# EAGLE schematic untitled (EAGLE 6.4)
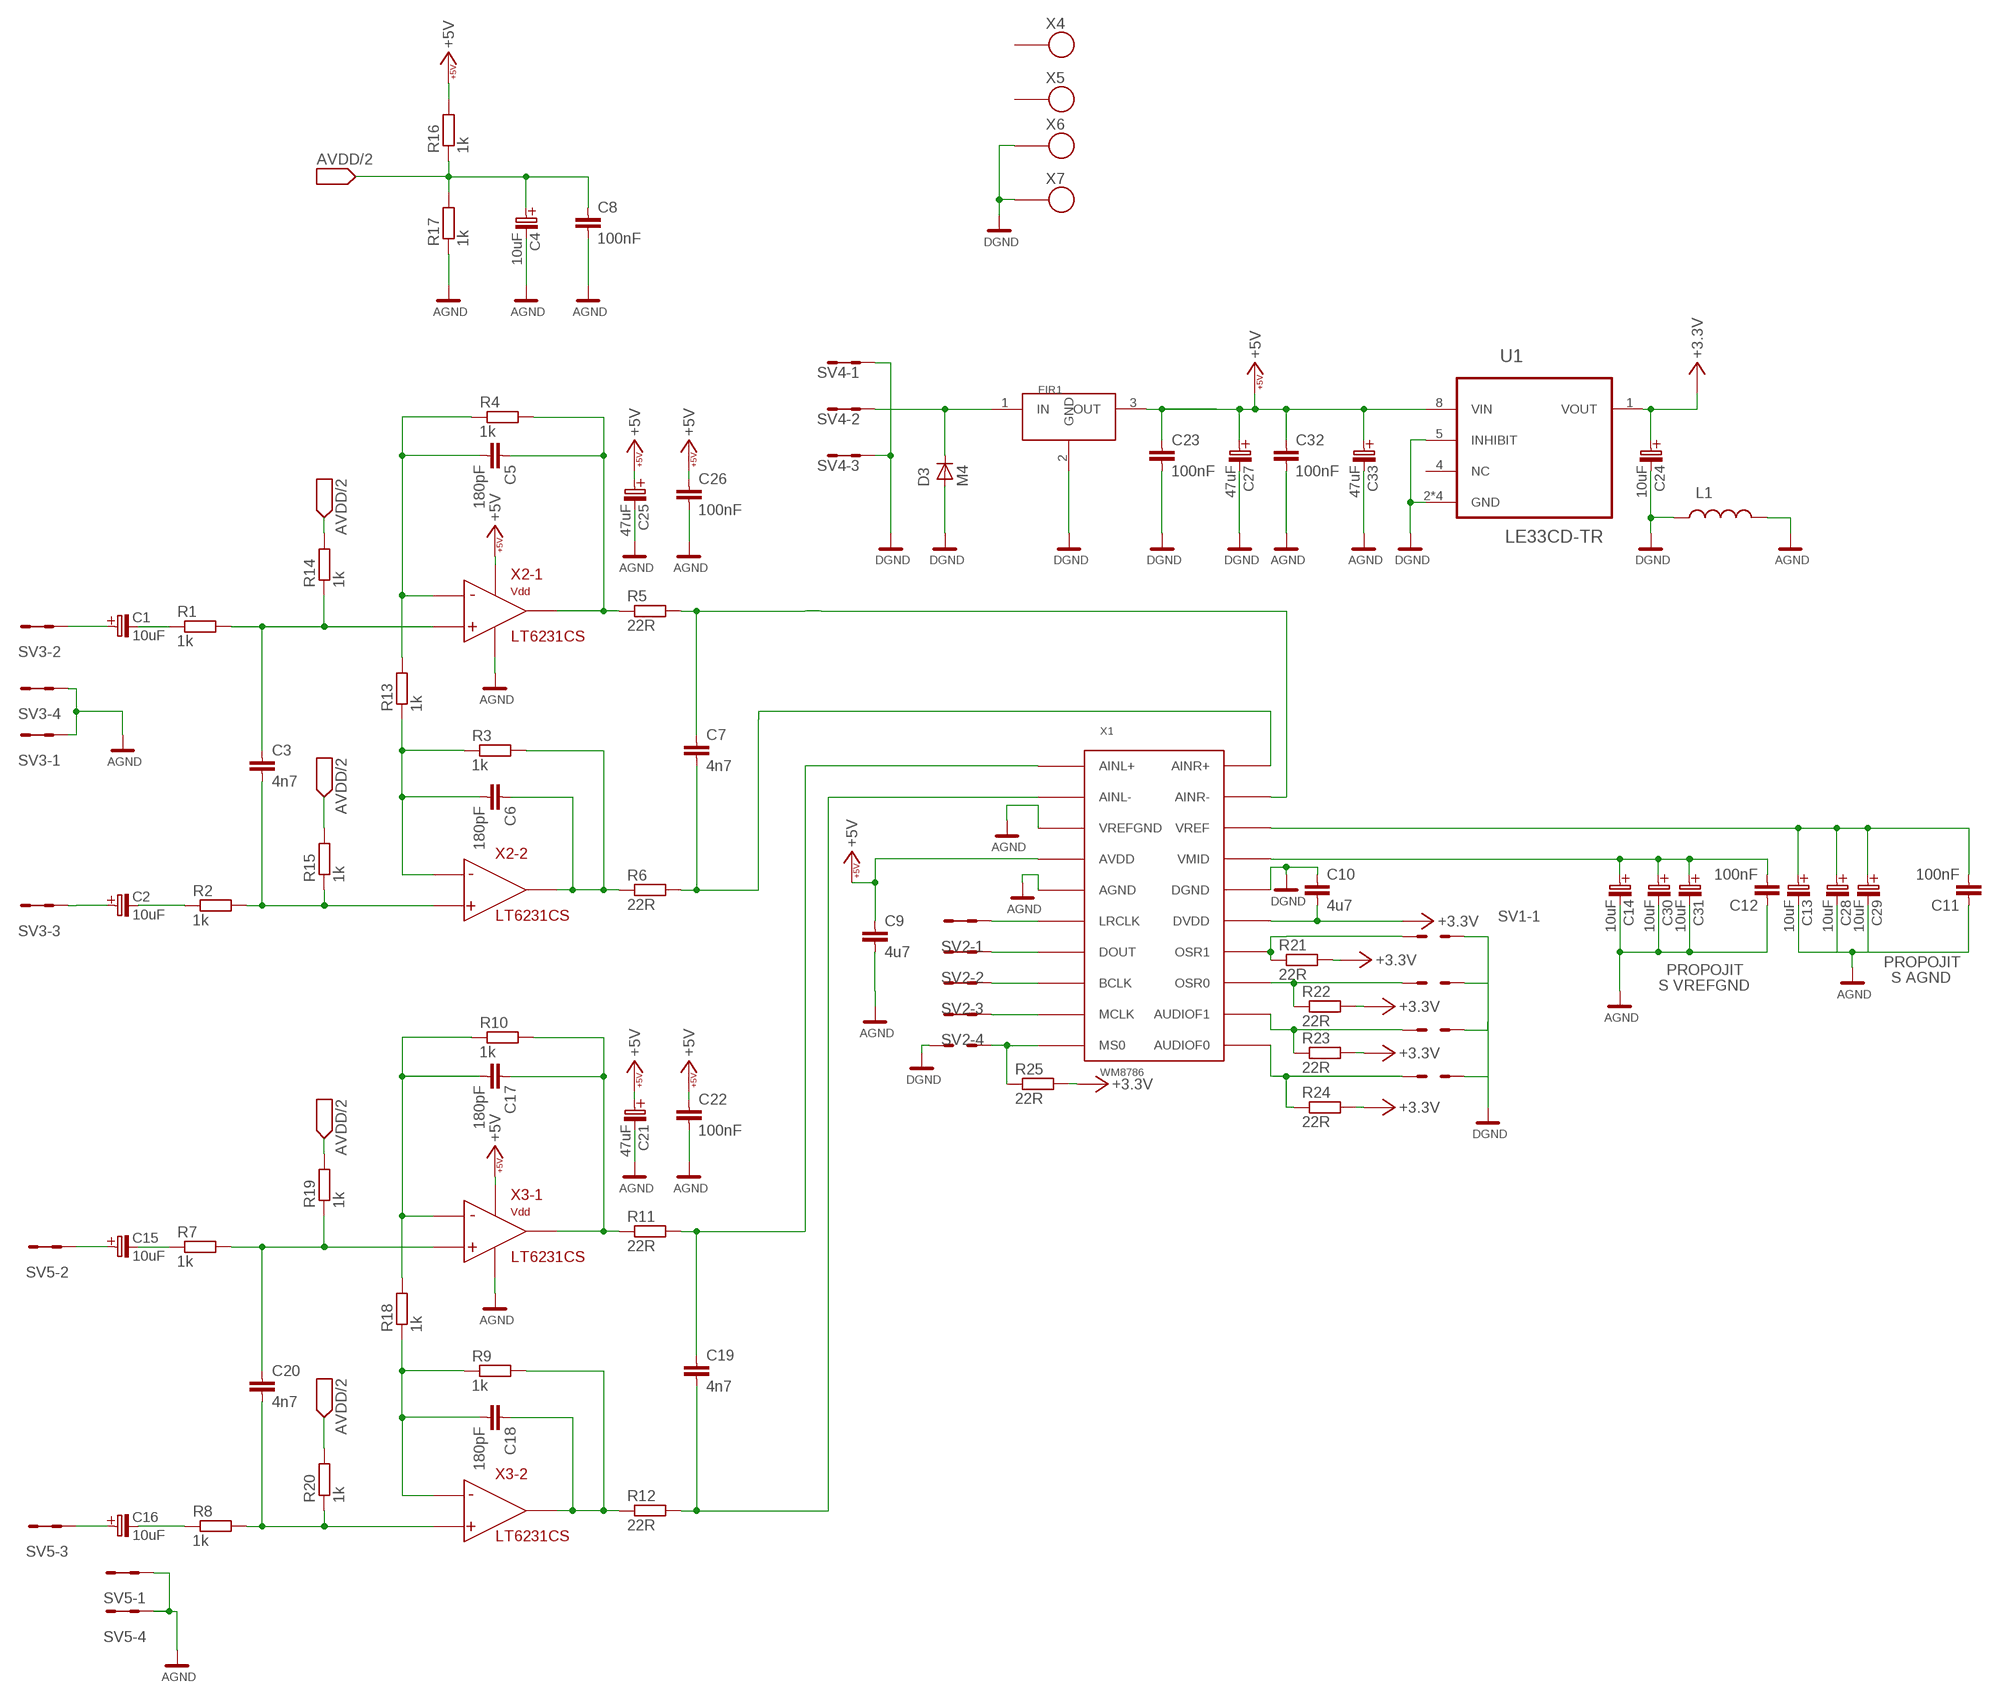
[diagram p0: schematic, sheet 1]

## Parts
C1  10uF  B  [B]
C2  10uF  B  [B]
C3  4n7  C0805  [C0805]
C4  10uF  B  [B]
C5  180pF  C0805  [C0805]
C6  180pF  C0805  [C0805]
C7  4n7  C0805  [C0805]
C8  100nF  C0805  [C0805]
C9  4u7  C0805  [C0805]
C10  4u7  C0805  [C0805]
C11  100nF  C0805  [C0805]
C12  100nF  C0805  [C0805]
C13  10uF  B  [B]
C14  10uF  B  [B]
C15  10uF  B  [B]
C16  10uF  B  [B]
C17  180pF  C0805  [C0805]
C18  180pF  C0805  [C0805]
C19  4n7  C0805  [C0805]
C20  4n7  C0805  [C0805]
C21  47uF  B  [B]
C22  100nF  C0805  [C0805]
C23  100nF  C0805  [C0805]
C24  10uF  B  [B]
C25  47uF  B  [B]
C26  100nF  C0805  [C0805]
C27  47uF  B  [B]
C28  10uF  B  [B]
C29  10uF  B  [B]
C30  10uF  B  [B]
C31  10uF  B  [B]
C32  100nF  C0805  [C0805]
C33  47uF  B  [B]
D3  M4  D-OB.SMA  [SMA]
FIR1  FILTR0805  [F0805]
L1  L0805  [L0805]
R1  1k  R0805  [0805]
R2  1k  R0805  [0805]
R3  1k  R0805  [0805]
R4  1k  R0805  [0805]
R5  22R  R0805  [0805]
R6  22R  R0805  [0805]
R7  1k  R0805  [0805]
R8  1k  R0805  [0805]
R9  1k  R0805  [0805]
R10  1k  R0805  [0805]
R11  22R  R0805  [0805]
R12  22R  R0805  [0805]
R13  1k  R0805  [0805]
R14  1k  R0805  [0805]
R15  1k  R0805  [0805]
R16  1k  R0805  [0805]
R17  1k  R0805  [0805]
R18  1k  R0805  [0805]
R19  1k  R0805  [0805]
R20  1k  R0805  [0805]
R21  22R  R0805  [0805]
R22  22R  R0805  [0805]
R23  22R  R0805  [0805]
R24  22R  R0805  [0805]
R25  22R  R0805  [0805]
SV1  MA05-3  [MA05-2]
SV2  MA04-2  [MA04-2]
SV3  MA04-2  [MA04-2]
SV4  MA03-2  [MA03-2]
SV5  MA04-2  [MA04-2]
U1  LE33CD-TR  [SOIC127P600X175-8N]
X1  WM8786  [SSOP20]
X2  LT6231CS  [SO8]
X3  LT6231CS  [SO8]
X4  SROUB3M  [SROUB3M]
X5  SROUB3M  [SROUB3M]
X6  SROUB3M  [SROUB3M]
X7  SROUB3M  [SROUB3M]

## Nets
1: C20.1 R7.2 R19.1 X3.3(-1:+)
4: C3.1 R1.2 R14.1 X2.3(-1:+)
+3.3V: C10.2 C24.+(C_EL+) R21.2 R22.2 R23.2 R24.2 R25.2 U1.1(VOUT) X1.15(DVDD)
+5V: C9.1 C21.+(C_EL+) C22.1 C23.1 C25.+(C_EL+) C26.1 C27.+(C_EL+) C32.1 C33.+(C_EL+) FIR1.3(OUT) R16.2 U1.8(VIN) X1.4(AVDD) X2.8(-1:VDD) X3.8(-1:VDD)
AGND: C4.-(C_EL-) C8.2 C9.2 C11.1 C12.1 C13.-(C_EL-) C14.-(C_EL-) C21.-(C_EL-) C22.2 C25.-(C_EL-) C26.2 C28.-(C_EL-) C29.-(C_EL-) C30.-(C_EL-) C31.-(C_EL-) C32.2 C33.-(C_EL-) L1.2 R17.1 SV3.1 SV3.2 SV3.7 SV3.8 SV5.1 SV5.2 SV5.7 SV5.8 X1.3(VREFGND) X1.5(AGND) X2.4(-1:GND) X3.4(-1:GND)
AUDIOOF0: R24.1 SV1.8 X1.11(AUDIOF0)
AUDIOOF1: R23.1 SV1.6 X1.12(AUDIOF1)
AVDD/2: C4.+(C_EL+) C8.1 R14.2 R15.2 R16.1 R17.2 R19.2 R20.2
BCLK: SV2.5 SV2.6 X1.8(BCLK)
DGND: C10.1 C23.2 C24.-(C_EL-) C27.-(C_EL-) D3.A FIR1.2(GND) L1.1 SV1.1 SV1.3 SV1.5 SV1.7 SV1.9 SV4.1 SV4.2 SV4.5 SV4.6 U1.2(GND) U1.3(GND) U1.5(INHIBIT) U1.6(GND) U1.7(GND) X1.16(DGND) X6.P$1 X7.P$1
DOUT: SV2.3 SV2.4 X1.7(DOUT)
LRCLK: SV2.1 SV2.2 X1.6(LRCLK)
MCLK: SV2.7 SV2.8 X1.9(MCLK)
MS0: R25.1 SV1.10 X1.10(MS0)
N$1: C5.2 R4.1 R13.2 X2.2(-1:-)
N$2: C1.-(C_EL-) R1.1
N$3: C16.+(C_EL+) SV5.5 SV5.6
N$4: C6.2 R3.1 R13.1 X2.6(-2:-)
N$5: C2.-(C_EL-) R2.1
N$6: C6.1 R3.2 R6.1 X2.7(-2:VOUT)
N$7: C7.1 R5.2 X1.19(AINR-)
N$8: C1.+(C_EL+) SV3.3 SV3.4
N$9: C17.2 R10.1 R18.2 X3.2(-1:-)
N$11: C15.-(C_EL-) R7.1
N$12: C18.2 R9.1 R18.1 X3.6(-2:-)
N$13: C16.-(C_EL-) R8.1
N$14: C18.1 R9.2 R12.1 X3.7(-2:VOUT)
N$15: C19.1 R11.2 X1.1(AINL+)
N$17: C15.+(C_EL+) SV5.3 SV5.4
N$18: C20.2 R8.2 R20.1 X3.5(-2:+)
N$19: C2.+(C_EL+) SV3.5 SV3.6
N$21: C19.2 R12.2 X1.2(AINL-)
N$25: C12.2 C14.+(C_EL+) C30.+(C_EL+) C31.+(C_EL+) X1.17(VMID)
N$26: C11.2 C13.+(C_EL+) C28.+(C_EL+) C29.+(C_EL+) X1.18(VREF)
N$32: C3.2 R2.2 R15.1 X2.5(-2:+)
N$34: C5.1 R4.2 R5.1 X2.1(-1:VOUT)
N$35: C17.1 R10.2 R11.1 X3.1(-1:VOUT)
N$38: C7.2 R6.2 X1.20(AINR+)
N$41: D3.K(C) FIR1.1(IN) SV4.3 SV4.4
OSR0: R22.1 SV1.4 X1.13(OSR0)
OSR1: R21.1 SV1.2 X1.14(OSR1)
Unconnected: U1.4(NC) X4.P$1 X5.P$1

## Notes on the sheet
- PROPOJIT
- PROPOJIT
- S AGND
- S VREFGND

## Library data of the parts
C1 C2 C4 C13-C16 C21 C24 C25 C27-C31 C33 = moje_C:B
C3 C5-C12 C17-C20 C22 C23 C26 C32 = moje_C:C0805
D3 = moje:D-OB.SMA: SMA
FIR1 = moje:FILTR0805
L1 = moje_L:L0805
R1-R25 = moje_R:R0805
SV1 = moje_hrebinky:MA05-3
SV2 SV3 SV5 = moje_hrebinky:MA04-2: PIN HEADER; OC_FARNELL: unknown; OC_NEWARK: unknown
SV4 = moje_hrebinky:MA03-2: PIN HEADER; OC_FARNELL: unknown; OC_NEWARK: unknown
U1 = moje_U:LE33CD-TR: Very low drop voltage regulators with inhibit; MPN: LE33CD-TR; OC_FARNELL: 1652371; OC_NEWARK: 89K1279; PACKAGE: SOIC-8; SUPPLIER: STMICROELECTRONICS
X1 = moje_io:WM8786
X2 X3 = moje_OZ:LT6231CS
X4-X7 = moje:SROUB3M